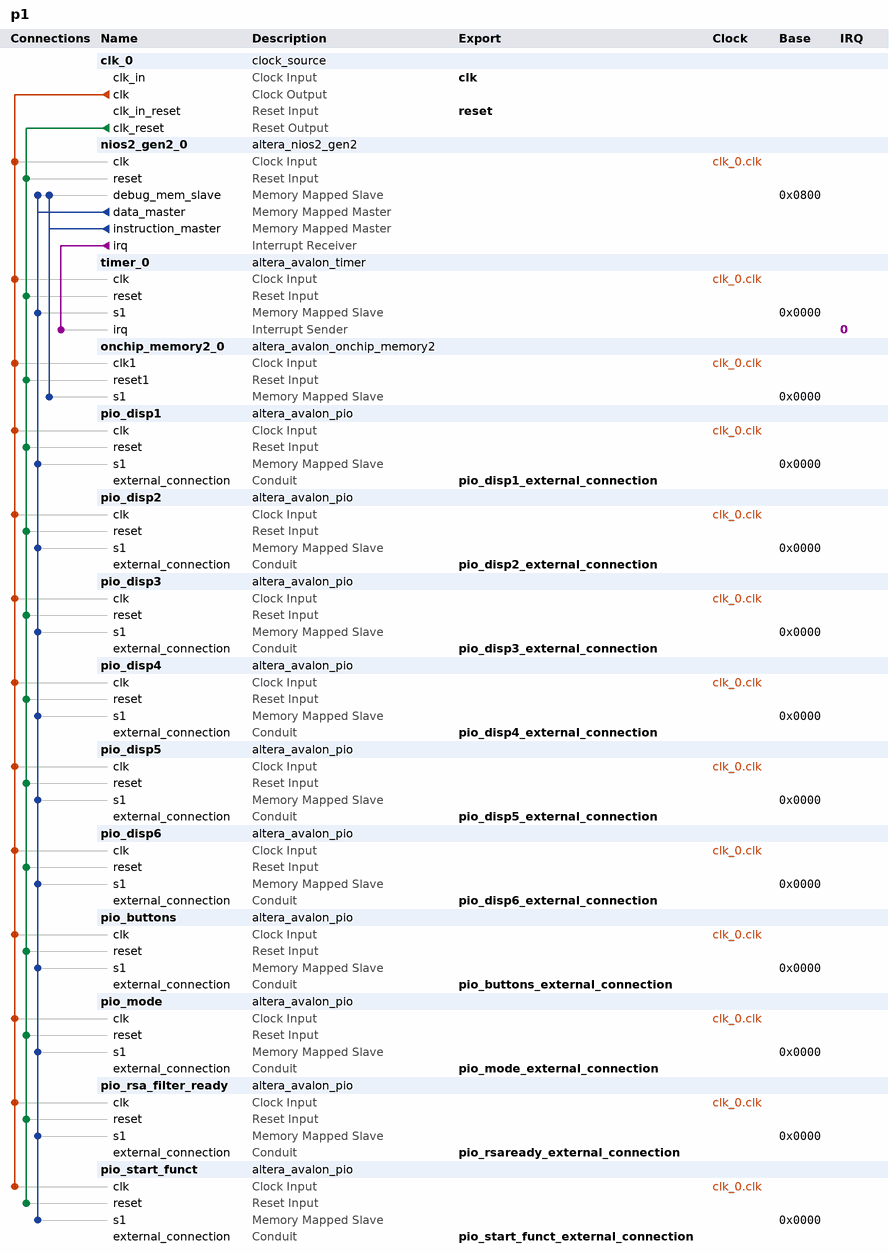
[diagram p0: system contents]
# Platform Designer (Qsys) system p1, Cyclone V 5CSEMA5F31C6
# Parameters at their usual value, and those the tool derives, are not listed.
package require -exact qsys 22.1
create_system p1
set_project_property DEVICE_FAMILY {Cyclone V}
set_project_property DEVICE 5CSEMA5F31C6

add_instance clk_0 clock_source 22.1
set_instance_parameter_value clk_0 clockFrequency 50000000

add_instance nios2_gen2_0 altera_nios2_gen2 22.1
set_instance_parameter_value nios2_gen2_0 dcache_size 2048
set_instance_parameter_value nios2_gen2_0 exceptionSlave None
set_instance_parameter_value nios2_gen2_0 icache_size 4096
set_instance_parameter_value nios2_gen2_0 impl Tiny
set_instance_parameter_value nios2_gen2_0 resetSlave None

add_instance timer_0 altera_avalon_timer 22.1
set_instance_parameter_value timer_0 alwaysRun true
set_instance_parameter_value timer_0 fixedPeriod true
set_instance_parameter_value timer_0 period 1
set_instance_parameter_value timer_0 periodUnits SEC
set_instance_parameter_value timer_0 snapshot false

add_instance onchip_memory2_0 altera_avalon_onchip_memory2 22.1
set_instance_parameter_value onchip_memory2_0 dataWidth 32
set_instance_parameter_value onchip_memory2_0 dualPort false
set_instance_parameter_value onchip_memory2_0 initMemContent true
set_instance_parameter_value onchip_memory2_0 initializationFileName onchip_mem.hex
set_instance_parameter_value onchip_memory2_0 memorySize 4096
set_instance_parameter_value onchip_memory2_0 writable false

add_instance pio_disp1 altera_avalon_pio 22.1
set_instance_parameter_value pio_disp1 direction Output
set_instance_parameter_value pio_disp1 width 7

add_instance pio_disp2 altera_avalon_pio 22.1
set_instance_parameter_value pio_disp2 direction Output
set_instance_parameter_value pio_disp2 width 7

add_instance pio_disp3 altera_avalon_pio 22.1
set_instance_parameter_value pio_disp3 direction Output
set_instance_parameter_value pio_disp3 width 7

add_instance pio_disp4 altera_avalon_pio 22.1
set_instance_parameter_value pio_disp4 direction Output
set_instance_parameter_value pio_disp4 width 7

add_instance pio_disp5 altera_avalon_pio 22.1
set_instance_parameter_value pio_disp5 direction Output
set_instance_parameter_value pio_disp5 width 7

add_instance pio_disp6 altera_avalon_pio 22.1
set_instance_parameter_value pio_disp6 direction Output
set_instance_parameter_value pio_disp6 width 7

add_instance pio_buttons altera_avalon_pio 22.1
set_instance_parameter_value pio_buttons direction InOut
set_instance_parameter_value pio_buttons width 4

add_instance pio_mode altera_avalon_pio 22.1
set_instance_parameter_value pio_mode direction InOut
set_instance_parameter_value pio_mode width 1

add_instance pio_rsa_filter_ready altera_avalon_pio 22.1
set_instance_parameter_value pio_rsa_filter_ready direction Output
set_instance_parameter_value pio_rsa_filter_ready width 2

add_instance pio_start_funct altera_avalon_pio 22.1
set_instance_parameter_value pio_start_funct direction InOut
set_instance_parameter_value pio_start_funct width 2

# connections
add_connection clk_0.clk nios2_gen2_0.clk clock
add_connection clk_0.clk onchip_memory2_0.clk1 clock
add_connection clk_0.clk pio_buttons.clk clock
add_connection clk_0.clk pio_disp1.clk clock
add_connection clk_0.clk pio_disp2.clk clock
add_connection clk_0.clk pio_disp3.clk clock
add_connection clk_0.clk pio_disp4.clk clock
add_connection clk_0.clk pio_disp5.clk clock
add_connection clk_0.clk pio_disp6.clk clock
add_connection clk_0.clk pio_mode.clk clock
add_connection clk_0.clk pio_rsa_filter_ready.clk clock
add_connection clk_0.clk pio_start_funct.clk clock
add_connection clk_0.clk timer_0.clk clock
add_connection clk_0.clk_reset nios2_gen2_0.reset reset
add_connection clk_0.clk_reset onchip_memory2_0.reset1 reset
add_connection clk_0.clk_reset pio_buttons.reset reset
add_connection clk_0.clk_reset pio_disp1.reset reset
add_connection clk_0.clk_reset pio_disp2.reset reset
add_connection clk_0.clk_reset pio_disp3.reset reset
add_connection clk_0.clk_reset pio_disp4.reset reset
add_connection clk_0.clk_reset pio_disp5.reset reset
add_connection clk_0.clk_reset pio_disp6.reset reset
add_connection clk_0.clk_reset pio_mode.reset reset
add_connection clk_0.clk_reset pio_rsa_filter_ready.reset reset
add_connection clk_0.clk_reset pio_start_funct.reset reset
add_connection clk_0.clk_reset timer_0.reset reset
add_connection nios2_gen2_0.data_master nios2_gen2_0.debug_mem_slave avalon
set_connection_parameter_value nios2_gen2_0.data_master/nios2_gen2_0.debug_mem_slave baseAddress 0x0800
add_connection nios2_gen2_0.data_master pio_buttons.s1 avalon
set_connection_parameter_value nios2_gen2_0.data_master/pio_buttons.s1 baseAddress 0x0000
add_connection nios2_gen2_0.data_master pio_disp1.s1 avalon
set_connection_parameter_value nios2_gen2_0.data_master/pio_disp1.s1 baseAddress 0x0000
add_connection nios2_gen2_0.data_master pio_disp2.s1 avalon
set_connection_parameter_value nios2_gen2_0.data_master/pio_disp2.s1 baseAddress 0x0000
add_connection nios2_gen2_0.data_master pio_disp3.s1 avalon
set_connection_parameter_value nios2_gen2_0.data_master/pio_disp3.s1 baseAddress 0x0000
add_connection nios2_gen2_0.data_master pio_disp4.s1 avalon
set_connection_parameter_value nios2_gen2_0.data_master/pio_disp4.s1 baseAddress 0x0000
add_connection nios2_gen2_0.data_master pio_disp5.s1 avalon
set_connection_parameter_value nios2_gen2_0.data_master/pio_disp5.s1 baseAddress 0x0000
add_connection nios2_gen2_0.data_master pio_disp6.s1 avalon
set_connection_parameter_value nios2_gen2_0.data_master/pio_disp6.s1 baseAddress 0x0000
add_connection nios2_gen2_0.data_master pio_mode.s1 avalon
set_connection_parameter_value nios2_gen2_0.data_master/pio_mode.s1 baseAddress 0x0000
add_connection nios2_gen2_0.data_master pio_rsa_filter_ready.s1 avalon
set_connection_parameter_value nios2_gen2_0.data_master/pio_rsa_filter_ready.s1 baseAddress 0x0000
add_connection nios2_gen2_0.data_master pio_start_funct.s1 avalon
set_connection_parameter_value nios2_gen2_0.data_master/pio_start_funct.s1 baseAddress 0x0000
add_connection nios2_gen2_0.data_master timer_0.s1 avalon
set_connection_parameter_value nios2_gen2_0.data_master/timer_0.s1 baseAddress 0x0000
add_connection nios2_gen2_0.instruction_master nios2_gen2_0.debug_mem_slave avalon
set_connection_parameter_value nios2_gen2_0.instruction_master/nios2_gen2_0.debug_mem_slave baseAddress 0x0800
add_connection nios2_gen2_0.instruction_master onchip_memory2_0.s1 avalon
set_connection_parameter_value nios2_gen2_0.instruction_master/onchip_memory2_0.s1 baseAddress 0x0000
add_connection nios2_gen2_0.irq timer_0.irq interrupt
set_connection_parameter_value nios2_gen2_0.irq/timer_0.irq irqNumber 0

# exported interfaces
add_interface clk clock sink
set_interface_property clk EXPORT_OF clk_0.clk_in
add_interface pio_buttons_external_connection conduit end
set_interface_property pio_buttons_external_connection EXPORT_OF pio_buttons.external_connection
add_interface pio_disp1_external_connection conduit end
set_interface_property pio_disp1_external_connection EXPORT_OF pio_disp1.external_connection
add_interface pio_disp2_external_connection conduit end
set_interface_property pio_disp2_external_connection EXPORT_OF pio_disp2.external_connection
add_interface pio_disp3_external_connection conduit end
set_interface_property pio_disp3_external_connection EXPORT_OF pio_disp3.external_connection
add_interface pio_disp4_external_connection conduit end
set_interface_property pio_disp4_external_connection EXPORT_OF pio_disp4.external_connection
add_interface pio_disp5_external_connection conduit end
set_interface_property pio_disp5_external_connection EXPORT_OF pio_disp5.external_connection
add_interface pio_disp6_external_connection conduit end
set_interface_property pio_disp6_external_connection EXPORT_OF pio_disp6.external_connection
add_interface pio_mode_external_connection conduit end
set_interface_property pio_mode_external_connection EXPORT_OF pio_mode.external_connection
add_interface pio_rsaready_external_connection conduit end
set_interface_property pio_rsaready_external_connection EXPORT_OF pio_rsa_filter_ready.external_connection
add_interface pio_start_funct_external_connection conduit end
set_interface_property pio_start_funct_external_connection EXPORT_OF pio_start_funct.external_connection
add_interface reset reset sink
set_interface_property reset EXPORT_OF clk_0.clk_in_reset

set_interconnect_requirement {$system} qsys_mm.clockCrossingAdapter HANDSHAKE
set_interconnect_requirement {$system} qsys_mm.enableEccProtection FALSE
set_interconnect_requirement {$system} qsys_mm.insertDefaultSlave FALSE
set_interconnect_requirement {$system} qsys_mm.maxAdditionalLatency 1

save_system p1.qsys
